# Altium schematic sheet bat_ctl.SchDoc: USB Battery Charger w/Solar In
size B; Engineer: Michael J. Kelly; Organization: CSB540otn - Outernet; Address1: AM335x Compute Board; Address2: (C) 2015; Address3: See us on the Web:; Address4: http://outernet.is; DocumentNumber: 9; Revision: V1.0; SheetNumber: 9; SheetTotal: 9
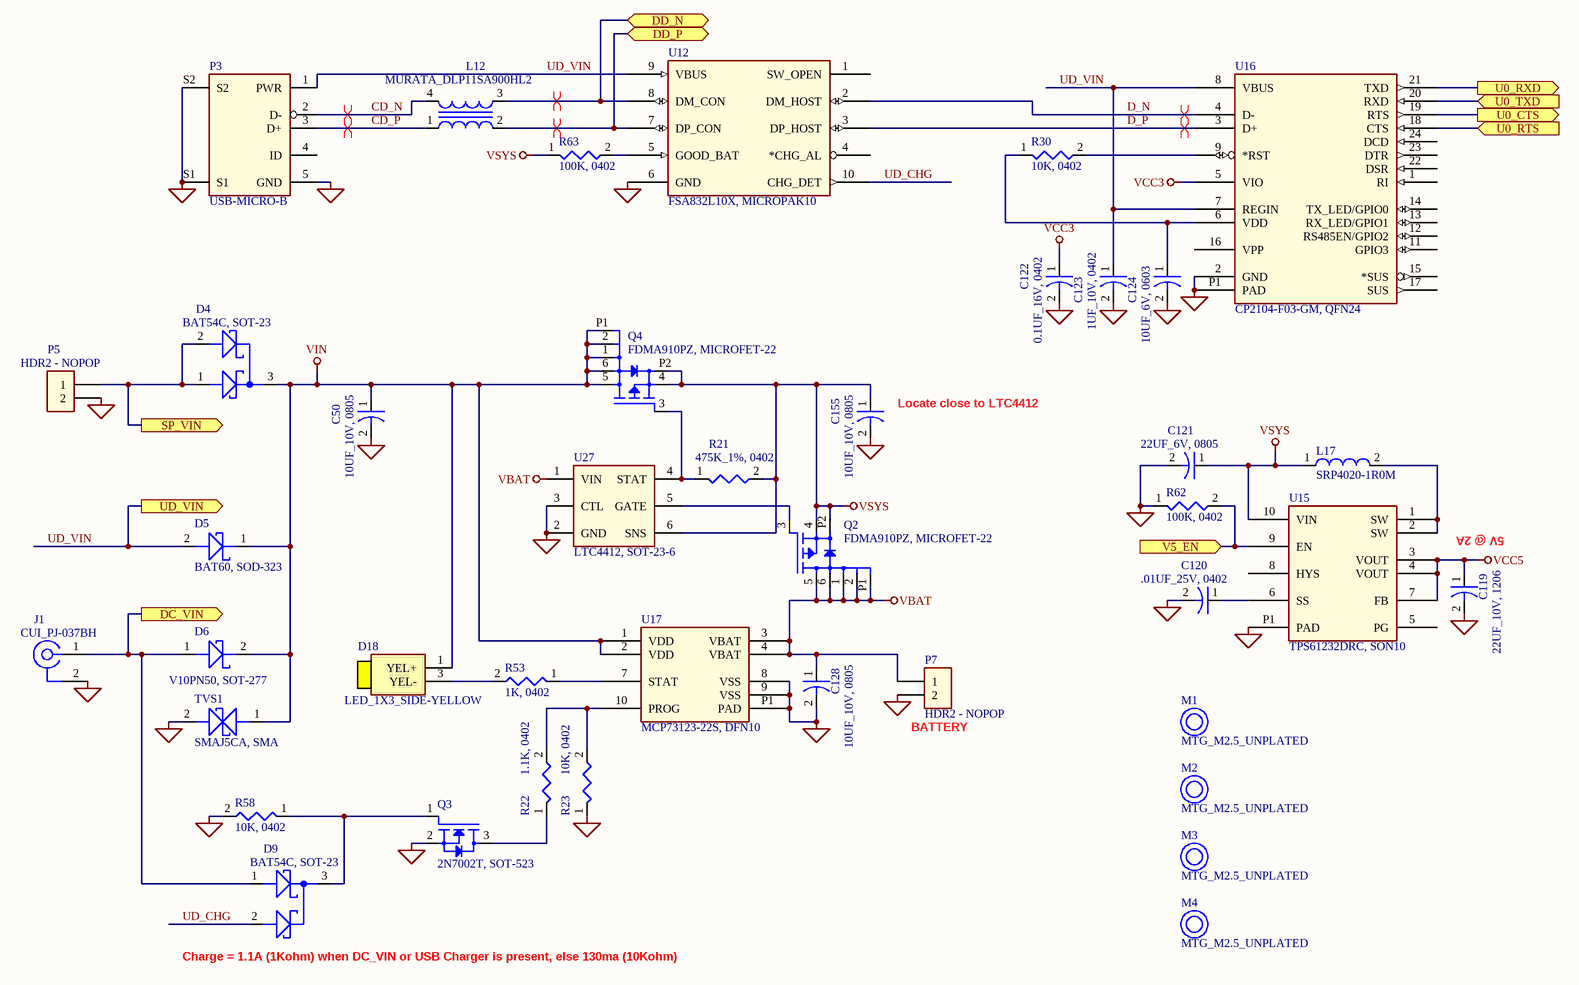
[diagram p0: bat_ctl.SchDoc]

## Parts
C50  10UF_10V, 0805  [0805C]
C119  22UF_10V, 1206  [1206C]
C120  .01UF_25V, 0402  [0402C]
C121  22UF_6V, 0805  [0805C]
C122  0.1UF_16V, 0402  [0402C]
C123  1UF_10V, 0402  [0402C]
C124  10UF_6V, 0603  [0603C]
C128  10UF_10V, 0805  [0805C]
C155  10UF_10V, 0805  [0805C]
D4  BAT54C, SOT-23  [SOT-23]
D5  BAT60, SOD-323  [SOD-323]
D6  V10PN50, SOT-277  [SOT-277]
D9  BAT54C, SOT-23  [SOT-23]
D18  LED_1X3_SIDE-YELLOW  [LED_1X3_SIDE-YELLOW]
J1  CUI_PJ-037BH  [CUI_PJ-037B]
L12  MURATA_DLP11SA900HL2  [PANASONIC_EXC24C]
L17  SRP4020-1R0M  [SRP4020]
M1  MTG_M2.5_UNPLATED  [MTG_M2.5_UNPLATED]
M2  MTG_M2.5_UNPLATED  [MTG_M2.5_UNPLATED]
M3  MTG_M2.5_UNPLATED  [MTG_M2.5_UNPLATED]
M4  MTG_M2.5_UNPLATED  [MTG_M2.5_UNPLATED]
P3  USB-MICRO-B  [USB-MICRO-B]
P5  HDR2 - NOPOP  [HDR2X1-NOPOP]
P7  HDR2 - NOPOP  [HDR2X1-NOPOP]
Q2  FDMA910PZ, MICROFET-22  [MICROFET-22]
Q3  2N7002T, SOT-523  [SOT-523]
Q4  FDMA910PZ, MICROFET-22  [MICROFET-22]
R21  475K_1%, 0402  [0402R]
R22  1.1K, 0402  [0402R]
R23  10K, 0402  [0402R]
R30  10K, 0402  [0402R]
R53  1K, 0402  [0402R]
R58  10K, 0402  [0402R]
R62  100K, 0402  [0402R]
R63  100K, 0402  [0402R]
TVS1  SMAJ5CA, SMA  [SMA]
U12  FSA832L10X, MICROPAK10  [MICROpack10]
U15  TPS61232DRC, SON10  [SON10]
U16  CP2104-F03-GM, QFN24  [QFN24]
U17  MCP73123-22S, DFN10  [DFN10]
U27  LTC4412, SOT-23-6  [SOT-23-6]

## Ports
DC_VIN (out), DD_N (bidir), DD_P (bidir), SP_VIN (out), U0_CTS (out), U0_RTS (in), U0_RXD (out), U0_TXD (in), UD_VIN (out), V5_EN (in)

## Nets
GND: C50.2 C119.2 C120.2 C121.2 C122.2 C123.2 C124.2 C128.2 C155.2 J1.2 P3.5(GND) P3.S1 P3.S2 P5.2 P7.2 Q3.2(SOURCE) R23.1 R58.2 R62.1 TVS1.2 U12.6(GND) U15.P1(PAD) U16.2(GND) U16.P1(PAD) U17.8(VSS) U17.9(VSS) U17.P1(PAD) U27.2(GND) U27.3(CTL)
VBAT: C128.1 P7.1 Q2.1 Q2.2 Q2.5(D1) Q2.6(D2) Q2.P1(D5) U17.3(VBAT) U17.4(VBAT) U27.1(VIN)
VCC3: C122.1 U16.5(VIO)
VCC5: C119.1 U15.3(VOUT) U15.4(VOUT) U15.7(FB)
VIN: C50.1 D4.3 D5.1(CATHODE) D6.2(CATHODE) D18.1(YEL+) Q4.1 Q4.2 Q4.5(D1) Q4.6(D2) Q4.P1(D5) TVS1.1 U17.1(VDD) U17.2(VDD)
VSYS: C121.1 C155.1 L17.1 Q2.4 Q2.P2 Q4.4 Q4.P2 R21.2 R63.1 U15.10(VIN) U27.6(SNS)
CD_N: L12.4 P3.2(D-)
CD_P: L12.1 P3.3(D+)
D_N: U12.2(DM_HOST) U16.4(D-)
D_P: U12.3(DP_HOST) U16.3(D+)
DC_VIN: D6.1(ANODE) D9.1 J1.1 ; port DC_VIN
DD_N: L12.3 U12.8(DM_CON) ; port DD_N
DD_P: L12.2 U12.7(DP_CON) ; port DD_P
SP_VIN: D4.1 D4.2 P5.1 ; port SP_VIN
U0_CTS: U16.19(RTS) ; port U0_CTS
U0_RTS: U16.18(CTS) ; port U0_RTS
U0_RXD: U16.21(TXD) ; port U0_RXD
U0_TXD: U16.20(RXD) ; port U0_TXD
UD_CHG: D9.2 U12.10(CHG_DET)
UD_VIN: C123.1 D5.2(ANODE) P3.1(PWR) U12.9(VBUS) U16.7(REGIN) U16.8(VBUS) ; port UD_VIN
V5_EN: R62.2 U15.9(EN) ; port V5_EN
NetC120_1: C120.1 U15.6(SS)
NetC124_1: C124.1 R30.1 U16.6(VDD)
NetD9_3: D9.3 Q3.1(GATE) R58.1
NetD18_3: D18.3(YEL-) R53.2
NetL17_2: L17.2 U15.1(SW) U15.2(SW)
NetQ2_3: Q2.3 U27.5(GATE)
NetQ3_3: Q3.3(DRAIN) R22.1
NetQ4_3: Q4.3 R21.1 U27.4(STAT)
NetR22_2: R22.2 R23.2 U17.10(PROG)
NetR30_2: R30.2 U16.9(*RST)
NetR53_1: R53.1 U17.7(STAT)
NetR63_2: R63.2 U12.5(GOOD_BAT)

Not connected (* = marked no-connect by the designer): P3 4(ID); U12 1(SW_OPEN) 4(*CHG_AL); U15 5(PG) 8(HYS); U16 1(RI) 11(GPIO3) 12(RS485EN/GPIO2) 13(RX_LED/GPIO1) 14(TX_LED/GPIO0) 15(*SUS) 16(VPP) 17(SUS) 22(DSR) 23(DTR) 24(DCD)

## Layout directives
differential pair: CD_N, CD_P, D_N, D_P, DD_N, DD_P

## Notes on the sheet
- (near C155) Locate close to LTC4412
- (near C119) 5V @ 2A
- (near P7) BATTERY
- (near D9) Charge = 1.1A (1Kohm) when DC_VIN or USB Charger is present, else 130ma (10Kohm)
- OUTERNET INC. - LANTERN PROJECT
- Title:
- Size:
- Date:
- B
- Engineer:
- Time:
- Rev:
- Sheet
- of
- File:

## Library data of the parts
C50 C128 C155 = 10UF_10V, 0805: CAP - 0805 PKG
C119 = 22UF_10V, 1206: CAP - 1206 PKG
C120 = .01UF_25V, 0402: CAP - 0402 PKG
C121 = 22UF_6V, 0805: CAP - 0805 PKG
C122 = 0.1UF_16V, 0402: CAP - 0402 PKG
C123 = 1UF_10V, 0402: CAP - 0402 PKG
C124 = 10UF_6V, 0603: CAP - 0603 PKG
D4 D9 = BAT54C, SOT-23: DIODE - DUAL SCHOTTKY, COMMON CATHODE, 30V, 200MA
D5 = BAT60, SOD-323: DIODE - POWER, SCHOTTKY, 10V, 3A
D6 = V10PN50, SOT-277: DIODE - SCHOTTKY, 50V, 10A
D18 = LED_1X3_SIDE-YELLOW: LED - SIDEVIEW, SMT, YELLOW
J1 = CUI_PJ-037BH: CONN - DC JACK, 2.5mm CENTER PLUS, 5 AMP
L12 = MURATA_DLP11SA900HL2: FERRITE - COMMON MODE FILTER, USB2/HDMI/GIGe, FILM
L17 = SRP4020-1R0M: INDUCTOR - 1.0UH, 5/6A, 4MM x 4MM x 2MM, 22mohm
M1-M4 = MTG_M2.5_UNPLATED: MTG HOLE - 2.75mm HOLE 2-56 OR M2.5
P3 = USB-MICRO-B: CONN - USB TYPE B MICRO
P5 P7 = HDR2 - NOPOP: HEADER - 2-PIN, HOLES ONLY FOR WIRE
Q2 Q4 = FDMA910PZ, MICROFET-22: P-FET - 20V, 7.2A @ 1.8Vgs, 34mohm
Q3 = 2N7002T, SOT-523: N-FET - 60V, 500ma @ 10V, Vgs(th) 2V
R21 = 475K_1%, 0402: RES - 0402 PKG
R22 = 1.1K, 0402: RES - 0402 PKG
R23 R30 R58 = 10K, 0402: RES - 0402 PKG
R53 = 1K, 0402: RES - 0402 PKG
R62 R63 = 100K, 0402: RES - 0402 PKG
TVS1 = SMAJ5CA, SMA: DIODE - TVS, 6.4V MIN., 7.25V MAX.
U12 = FSA832L10X, MICROPAK10: USB - BATTERY CHARGER DETECTION W/SWITCH
U15 = TPS61232DRC, SON10: SWITCHER - 500ua Iq, BOOST 5A, 2.3V TO 5.5V IN, 2.5V TO 5.5V OUT
U16 = CP2104-F03-GM, QFN24: USB - UART W/4 GPIO
U17 = MCP73123-22S, DFN10: IC - BATTERY CHARGER, 1 CELL LiFePO4, 1.1 AMAX
U27 = LTC4412, SOT-23-6: IC - POWER SOURCE SELECTOR